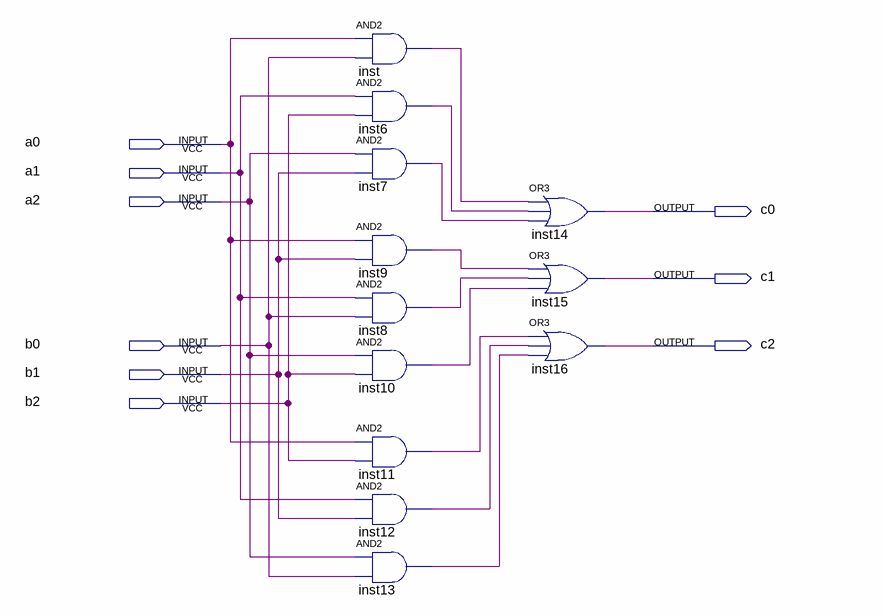
[diagram p0: schematic sheet]
// Quartus schematic div3.bdf as structural Verilog: 12 symbols, 9 pins
module div3 (
  input  a0,
  input  a1,
  input  a2,
  input  b0,
  input  b1,
  input  b2,
  output c0,
  output c1,
  output c2
);

  wire inst6_out, inst7_out, inst8_out, inst9_out, inst10_out, inst11_out, inst12_out, inst13_out, inst_out;

  and inst (inst_out, a0, b0);
  and inst6 (inst6_out, a1, b2);
  and inst7 (inst7_out, a2, b1);
  and inst9 (inst9_out, a0, b1);
  and inst8 (inst8_out, a1, b0);
  and inst10 (inst10_out, a2, b2);
  and inst11 (inst11_out, a0, b2);
  and inst12 (inst12_out, a1, b1);
  and inst13 (inst13_out, a2, b0);
  or inst14 (c0, inst_out, inst6_out, inst7_out);
  or inst15 (c1, inst9_out, inst8_out, inst10_out);
  or inst16 (c2, inst11_out, inst12_out, inst13_out);
endmodule
